# Altium project Atmega_328p_MCU_Circuit.PrjPcb
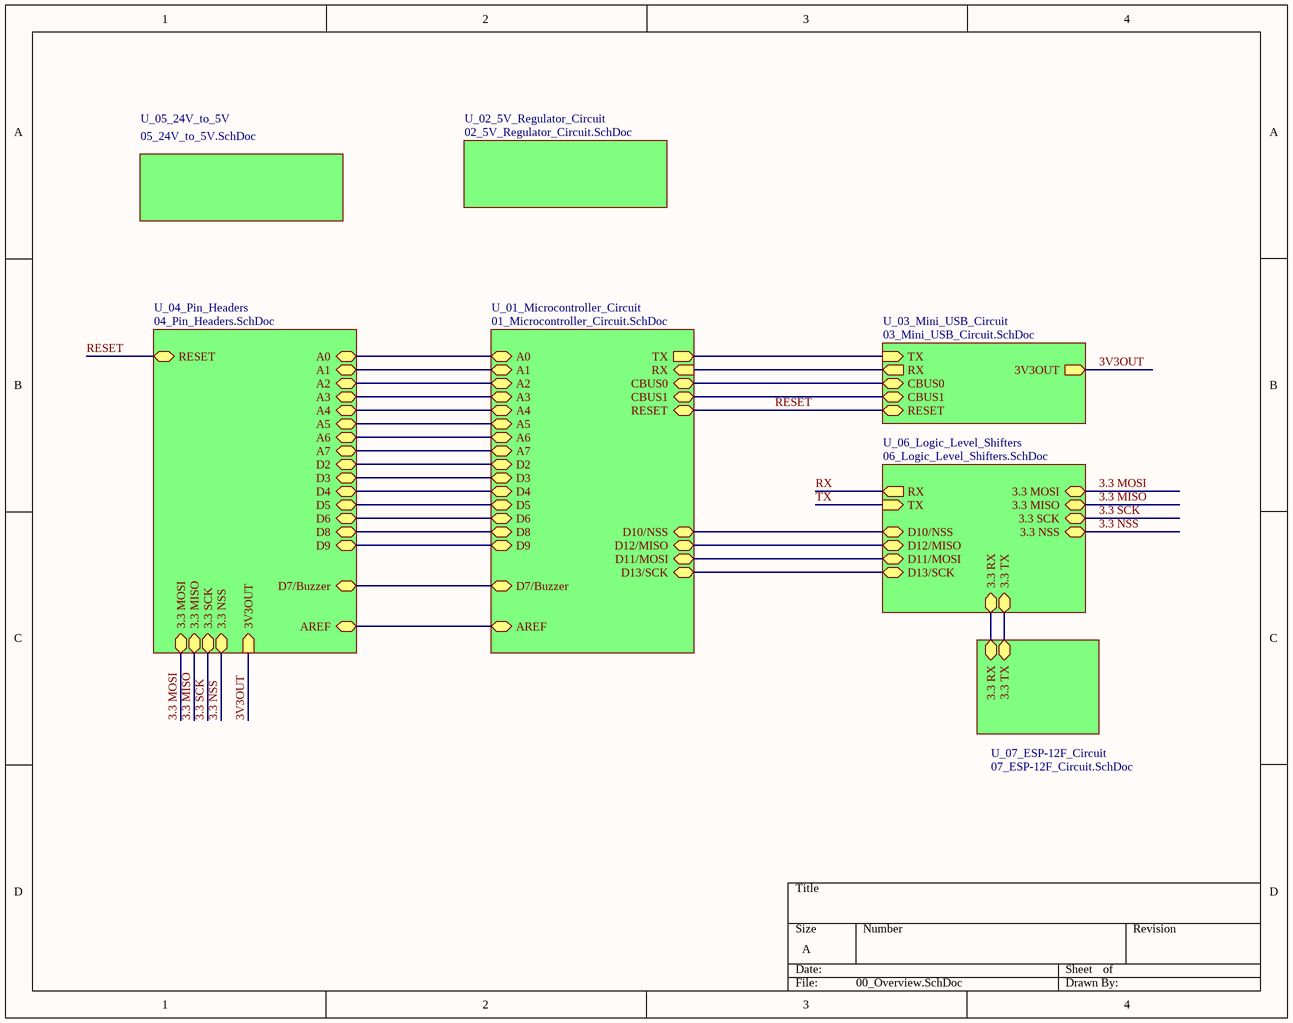
[diagram p0: 00_Overview.SchDoc]
7 sheets, 62 parts. Net scope: hierarchical (ports join the sheet entries above them; power ports are global).
Board file: PCB.PcbDoc
Sheets:
  00_Overview.SchDoc
    U_01_Microcontroller_Circuit = 01_Microcontroller_Circuit.SchDoc
    U_04_Pin_Headers = 04_Pin_Headers.SchDoc
    U_03_Mini_USB_Circuit = 03_Mini_USB_Circuit.SchDoc
    U_02_5V_Regulator_Circuit = 02_5V_Regulator_Circuit.SchDoc
    U_07_ESP-12F_Circuit = 07_ESP-12F_Circuit.SchDoc
    U_06_Logic_Level_Shifters = 06_Logic_Level_Shifters.SchDoc

## Sheet 00_Overview.SchDoc
size A; SheetNumber: 1; SheetTotal: 7

### Sub-sheets
U_01_Microcontroller_Circuit = 01_Microcontroller_Circuit.SchDoc: RX (in), TX (out), A0 (bidir), A1 (bidir), A2 (bidir), A3 (bidir), A4 (bidir), A5 (bidir), A6 (bidir), A7 (bidir), D2 (bidir), D3 (bidir), D4 (bidir), D5 (bidir), D6 (bidir), D8 (bidir), D9 (bidir), RESET (bidir), CBUS0 (bidir), CBUS1 (bidir), D11/MOSI (bidir), D12/MISO (bidir), AREF (bidir), D13/SCK (bidir), D10/NSS (bidir), D7/Buzzer (bidir)
U_02_5V_Regulator_Circuit = 02_5V_Regulator_Circuit.SchDoc: no entries
U_03_Mini_USB_Circuit = 03_Mini_USB_Circuit.SchDoc: TX (in), RX (out), RESET (bidir), CBUS0 (bidir), CBUS1 (bidir), 3V3OUT (out)
U_04_Pin_Headers = 04_Pin_Headers.SchDoc: RESET (bidir), D2 (bidir), D3 (bidir), D4 (bidir), D5 (bidir), D6 (bidir), D8 (bidir), D9 (bidir), A1 (bidir), A0 (bidir), AREF (bidir), A6 (bidir), A5 (bidir), A4 (bidir), A3 (bidir), A2 (bidir), A7 (bidir), D7/Buzzer (bidir), 3.3 MOSI (bidir), 3.3 NSS (bidir), 3.3 MISO (bidir), 3.3 SCK (bidir), 3V3OUT (in)
U_05_24V_to_5V = 05_24V_to_5V.SchDoc (file not in this document): no entries
U_06_Logic_Level_Shifters = 06_Logic_Level_Shifters.SchDoc: 3.3 NSS (bidir), 3.3 MISO (bidir), 3.3 MOSI (bidir), 3.3 SCK (bidir), D10/NSS (bidir), D12/MISO (bidir), D11/MOSI (bidir), D13/SCK (bidir), TX (in), RX (out), 3.3 RX (bidir), 3.3 TX (bidir)
U_07_ESP-12F_Circuit = 07_ESP-12F_Circuit.SchDoc: 3.3 TX (bidir), 3.3 RX (bidir)

### Nets
3.3 MISO: sheet U_04_Pin_Headers/3.3 MISO, sheet U_06_Logic_Level_Shifters/3.3 MISO
3.3 MOSI: sheet U_04_Pin_Headers/3.3 MOSI, sheet U_06_Logic_Level_Shifters/3.3 MOSI
3.3 NSS: sheet U_04_Pin_Headers/3.3 NSS, sheet U_06_Logic_Level_Shifters/3.3 NSS
3.3 RX: sheet U_07_ESP-12F_Circuit/3.3 RX, sheet U_06_Logic_Level_Shifters/3.3 RX
3.3 SCK: sheet U_04_Pin_Headers/3.3 SCK, sheet U_06_Logic_Level_Shifters/3.3 SCK
3.3 TX: sheet U_07_ESP-12F_Circuit/3.3 TX, sheet U_06_Logic_Level_Shifters/3.3 TX
3V3OUT: sheet U_04_Pin_Headers/3V3OUT, sheet U_03_Mini_USB_Circuit/3V3OUT
A0: sheet U_01_Microcontroller_Circuit/A0, sheet U_04_Pin_Headers/A0
A1: sheet U_01_Microcontroller_Circuit/A1, sheet U_04_Pin_Headers/A1
A2: sheet U_01_Microcontroller_Circuit/A2, sheet U_04_Pin_Headers/A2
A3: sheet U_01_Microcontroller_Circuit/A3, sheet U_04_Pin_Headers/A3
A4: sheet U_01_Microcontroller_Circuit/A4, sheet U_04_Pin_Headers/A4
A5: sheet U_01_Microcontroller_Circuit/A5, sheet U_04_Pin_Headers/A5
A6: sheet U_01_Microcontroller_Circuit/A6, sheet U_04_Pin_Headers/A6
A7: sheet U_01_Microcontroller_Circuit/A7, sheet U_04_Pin_Headers/A7
AREF: sheet U_01_Microcontroller_Circuit/AREF, sheet U_04_Pin_Headers/AREF
CBUS0: sheet U_01_Microcontroller_Circuit/CBUS0, sheet U_03_Mini_USB_Circuit/CBUS0
CBUS1: sheet U_01_Microcontroller_Circuit/CBUS1, sheet U_03_Mini_USB_Circuit/CBUS1
D2: sheet U_01_Microcontroller_Circuit/D2, sheet U_04_Pin_Headers/D2
D3: sheet U_01_Microcontroller_Circuit/D3, sheet U_04_Pin_Headers/D3
D4: sheet U_01_Microcontroller_Circuit/D4, sheet U_04_Pin_Headers/D4
D5: sheet U_01_Microcontroller_Circuit/D5, sheet U_04_Pin_Headers/D5
D6: sheet U_01_Microcontroller_Circuit/D6, sheet U_04_Pin_Headers/D6
D7/Buzzer: sheet U_01_Microcontroller_Circuit/D7/Buzzer, sheet U_04_Pin_Headers/D7/Buzzer
D8: sheet U_01_Microcontroller_Circuit/D8, sheet U_04_Pin_Headers/D8
D9: sheet U_01_Microcontroller_Circuit/D9, sheet U_04_Pin_Headers/D9
D10/NSS: sheet U_01_Microcontroller_Circuit/D10/NSS, sheet U_06_Logic_Level_Shifters/D10/NSS
D11/MOSI: sheet U_01_Microcontroller_Circuit/D11/MOSI, sheet U_06_Logic_Level_Shifters/D11/MOSI
D12/MISO: sheet U_01_Microcontroller_Circuit/D12/MISO, sheet U_06_Logic_Level_Shifters/D12/MISO
D13/SCK: sheet U_01_Microcontroller_Circuit/D13/SCK, sheet U_06_Logic_Level_Shifters/D13/SCK
RESET: sheet U_01_Microcontroller_Circuit/RESET, sheet U_04_Pin_Headers/RESET, sheet U_03_Mini_USB_Circuit/RESET
RXD: sheet U_01_Microcontroller_Circuit/TX, sheet U_03_Mini_USB_Circuit/TX
TXD: sheet U_01_Microcontroller_Circuit/RX, sheet U_03_Mini_USB_Circuit/RX

## Sheet 01_Microcontroller_Circuit.SchDoc
size A; SheetNumber: 2; SheetTotal: 8
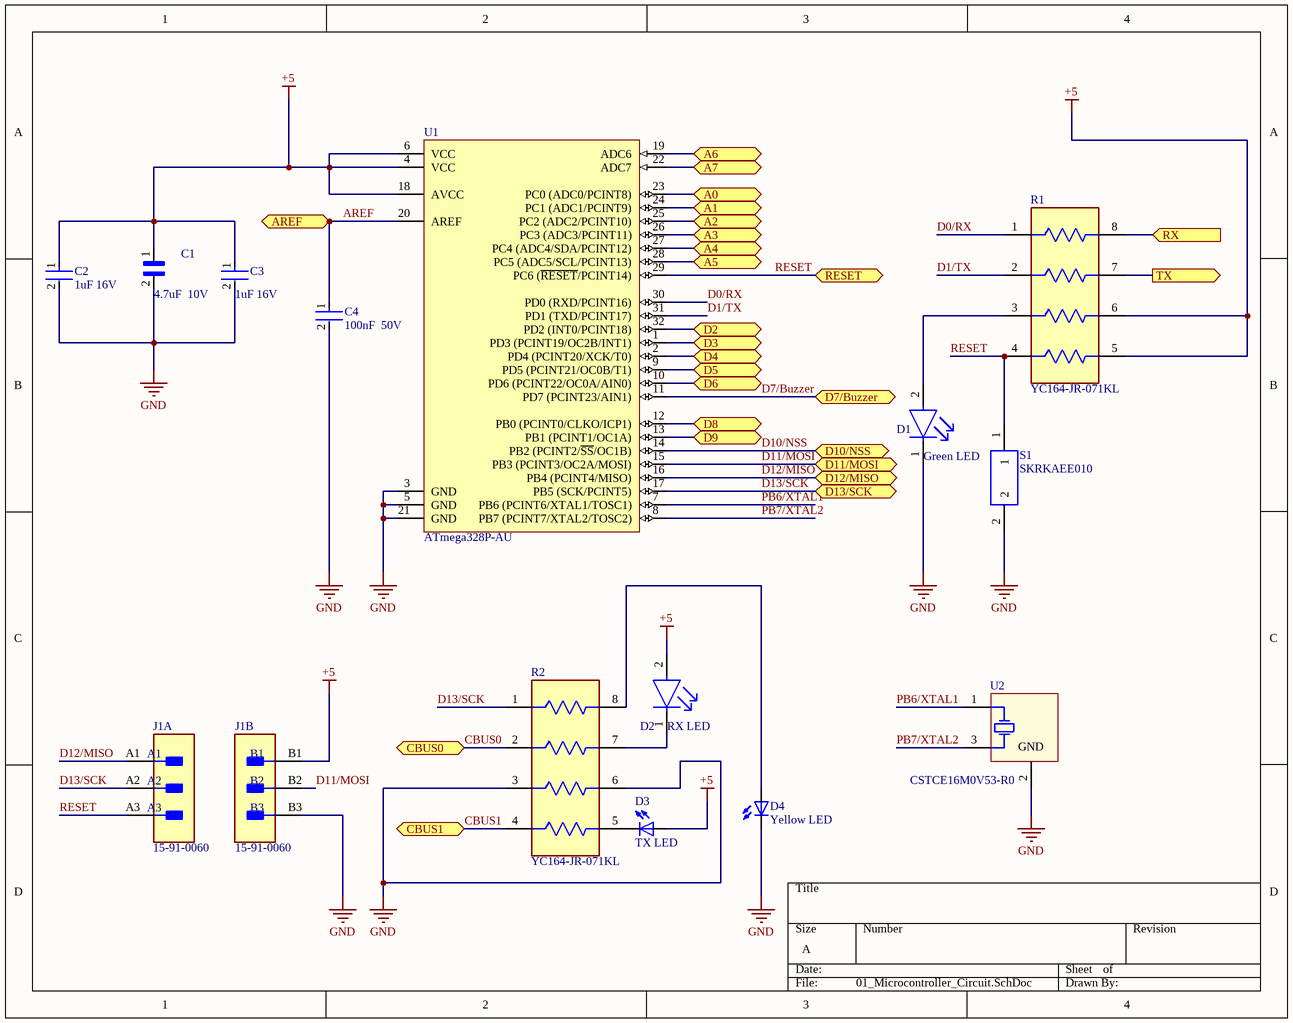
[diagram p1: 01_Microcontroller_Circuit.SchDoc]

### Parts
C1  4.7uF  10V  [CAPC1608X90]
C2  1uF 16V  [FP-CL10B105KO8NNNC-MFG]
C3  1uF 16V  [FP-CL10B105KO8NNNC-MFG]
C4  100nF  50V  [FP-0805-L_2_01_0_2-W_1_25-IPC_C]
D1  Green LED  [FP-LTST-C171KGKT-MFG]
D2  RX LED  [FP-LTST-C171KGKT-MFG]
D3  TX LED  [DIOC200X125X110]
D4  Yellow LED  [DIOC200X125X110]
J1  15-91-0060  [FP-15-91-0060-MFG]  (parts A,B of 2)
R1  YC164-JR-071KL  [FP-YC164-MFG]
R2  YC164-JR-071KL  [FP-YC164-MFG]
S1  SKRKAEE010  [SKRK]
U1  ATmega328P-AU  [32A_M]
U2  CSTCE16M0V53-R0  [MURA-CSTCE_V-3_V]

### Ports
A0 (bidir, see 00_Overview[2B], 04_Pin_Headers[3C]), A1 (bidir, see 00_Overview[2B], 04_Pin_Headers[3C]), A2 (bidir, see 00_Overview[2B], 04_Pin_Headers[3B]), A3 (bidir, see 00_Overview[2B], 04_Pin_Headers[3B]), A4 (bidir, see 00_Overview[2B], 04_Pin_Headers[3B]), A5 (bidir, see 00_Overview[2B], 04_Pin_Headers[3B]), A6 (bidir, see 00_Overview[2B], 04_Pin_Headers[3B]), A7 (bidir, see 00_Overview[2B], 04_Pin_Headers[3B]), AREF (bidir, see 00_Overview[2C], 04_Pin_Headers[3C]), CBUS0 (bidir, see 00_Overview[3B], 03_Mini_USB_Circuit[3B]), CBUS1 (bidir, see 00_Overview[3B], 03_Mini_USB_Circuit[3B]), D2 (bidir, see 00_Overview[2B], 04_Pin_Headers[1A]), D3 (bidir, see 00_Overview[2B], 04_Pin_Headers[1B]), D4 (bidir, see 00_Overview[2B], 04_Pin_Headers[1B]), D5 (bidir, see 00_Overview[2B], 04_Pin_Headers[1B]), D6 (bidir, see 00_Overview[2C], 04_Pin_Headers[1B]), D7/Buzzer (bidir, see 00_Overview[2C], 04_Pin_Headers[2D]), D8 (bidir, see 00_Overview[2C], 04_Pin_Headers[1B]), D9 (bidir, see 00_Overview[2C], 04_Pin_Headers[1B]), D10/NSS (bidir, see 00_Overview[3C], 06_Logic_Level_Shifters[2B]), D11/MOSI (bidir, see 00_Overview[3C], 06_Logic_Level_Shifters[4B]), D12/MISO (bidir, see 00_Overview[3C], 06_Logic_Level_Shifters[2C]), D13/SCK (bidir, see 00_Overview[3C], 06_Logic_Level_Shifters[4C]), RESET (bidir, see 00_Overview[3B], 03_Mini_USB_Circuit[4B], 04_Pin_Headers[1A]), RX (in, see 00_Overview[3B], 03_Mini_USB_Circuit[3A]), TX (out, see 00_Overview[3B], 03_Mini_USB_Circuit[3B])

### Nets
+5: C1.1 C2.1 C3.1 D2.2(A) D3.POS J1.B1 R1.5 R1.6 U1.4(VCC) U1.6(VCC) U1.18(AVCC)
GND: C1.2 C2.2 C3.2 C4.2 D1.1(C) D4.NEG J1.B3 R2.3 R2.6 S1.2 U1.3(GND) U1.5(GND) U1.21(GND) U2.2(GND)
A0: U1.23(PC0_(ADC0/PCINT8)) ; port A0
A1: U1.24(PC1_(ADC1/PCINT9)) ; port A1
A2: U1.25(PC2_(ADC2/PCINT10)) ; port A2
A3: U1.26(PC3_(ADC3/PCINT11)) ; port A3
A4: U1.27(PC4_(ADC4/SDA/PCINT12)) ; port A4
A5: U1.28(PC5_(ADC5/SCL/PCINT13)) ; port A5
A6: U1.19(ADC6) ; port A6
A7: U1.22(ADC7) ; port A7
AREF: C4.1 U1.20(AREF) ; port AREF
CBUS0: R2.2 ; port CBUS0
CBUS1: R2.4 ; port CBUS1
D0/RX: R1.1 U1.30(PD0_(RXD/PCINT16))
D1/TX: R1.2 U1.31(PD1_(TXD/PCINT17))
D2: U1.32(PD2_(INT0/PCINT18)) ; port D2
D3: U1.1(PD3_(PCINT19/OC2B/INT1)) ; port D3
D4: U1.2(PD4_(PCINT20/XCK/T0)) ; port D4
D5: U1.9(PD5_(PCINT21/OC0B/T1)) ; port D5
D6: U1.10(PD6_(PCINT22/OC0A/AIN0)) ; port D6
D7/Buzzer: U1.11(PD7_(PCINT23/AIN1)) ; port D7/Buzzer
D8: U1.12(PB0_(PCINT0/CLKO/ICP1)) ; port D8
D9: U1.13(PB1_(PCINT1/OC1A)) ; port D9
D10/NSS: U1.14(PB2_(PCINT2/~{SS}/OC1B)) ; port D10/NSS
D11/MOSI: J1.B2 U1.15(PB3_(PCINT3/OC2A/MOSI)) ; port D11/MOSI
D12/MISO: J1.A1 U1.16(PB4_(PCINT4/MISO)) ; port D12/MISO
D13/SCK: J1.A2 R2.1 U1.17(PB5_(SCK/PCINT5)) ; port D13/SCK
PB6/XTAL1: U1.7(PB6_(PCINT6/XTAL1/TOSC1)) U2.1(C1)
PB7/XTAL2: U1.8(PB7_(PCINT7/XTAL2/TOSC2)) U2.3(C2)
RESET: J1.A3 R1.4 S1.1 U1.29(PC6_(~{RESET}/PCINT14)) ; port RESET
RXD: R1.7 ; port TX
TXD: R1.8 ; port RX
NetD1_2: D1.2(A) R1.3
NetD2_1: D2.1(C) R2.7
NetD3_NEG: D3.NEG R2.5
NetD4_POS: D4.POS R2.8

### Library data of the parts
C1 = CC0603ZRY5V5BB475: SnapEDA_Link: https://www.snapeda.com/parts/CC0603ZRY5V5BB475/Yageo/view-part/?ref=snap; Check_prices: https://www.snapeda.com/parts/CC0603ZRY5V5BB475/Yageo/view-part/?ref=eda; Value: *
C2 C3 = CMP-2000-06093-2: CAP CER 1UF 16V X7R 0603; Manufacturer: Samsung Electro-Mechanics America, Inc; Manufacturer Part Number: CL10B105KO8NNNC; Temperature Coefficient: 15%; Material: Ceramic; Tolerance: 10%; Voltage Rating: 16V; Automotive: No; ComponentLink2Description: Datasheet; Device Class L3: Ceramic Capacitors; Capacitance: 1uF; Temperature Characteristic: X7R; Temperature Range High: +125°C; Digikey Description: CAP CER 1UF 16V X7R 0603; Device Class L2: Capacitors; Octopart: https://octopart.com/cl10b105ko8nnnc-samsung-19018973; ComponentLink2URL: http://www.samsungsem.com/global/front/downloadcms.do?path=%2F%2Fglobal%2F%2Fsupport%2F%2Fproduct-search%2F%2Fmlcc%2F%2F__icsFiles%2F%2Fafieldfile%2F%2F2019%2F%2F06%2F%2F18&fileName=CL10B105KO8NNNC-19.pdf; Lead Free: Yes; Height: 0.9mm; Package: CL10B105KO8NNNC; Temperature Range Low: -55°C; Value: 1uF; Device Class L1: Passive Components; RoHS: TRUE; Temperature: -55°C to +125°C; Category: Cap; Ipc Land Pattern Name: CAPC16080X80
C4 = CMP-2000-05016-2: General Purpose Ceramic Capacitor, 0805, 100nF, 10%, X7R, 0.15, 50V; Dissipation Factor: 2.5%; Insulation Resistance: 100GR; Voltage Rating (DC): 50V; Package Quantity: 4000; Tolerance: 10%; Voltage Rating: 50V; Dielectric: X7R; Case/Package: 0805; Lead Free: Lead Free; Dielectric Material: Ceramic; Thickness: 0.037inch; Weight: 0.001411oz; Max Operating Temperature: 125°C; REACH SVHC: No SVHC; Mount: Surface Mount; RoHS Compliant: Yes; Depth: 1.25mm; Height: 0.5mm; Case Code (Metric): 2012; Length: 2mm; Termination: Standard; Case Code (Imperial): 0805; Number of Pins: 2; Voltage: 50V; Radiation Hardening: No; Min Operating Temperature: -55°C; Capacitance: 100nF; Width: 1.2mm; Series: MLCC X7R; Packaging: Cut Tape
D1 D2 = CMP-22017-000037-1: LED GREEN CLEAR SMD; Number of LEDs: 1; Viewing Angle: 130°; Lens Style: Rectangular; Dominant Wavelength: 571nm; Test Current: 20mA; Luminous Intensity: 35mcd; Power Rating: 75mW; Forward Voltage: 2.4V; Forward Current: 30mA; Reverse Voltage: 5V; Lens Color: Colorless; Wavelength: 574nm; Height: 0.8mm; Illumination Color: Green; Length: 2mm; Case/Package: 0805; Number of Pins: 2; Number of Elements: 1; Package Quantity: 1; Depth: 1.25mm; Lens Transparency: Clear; Width: 1.25mm; Color: Green; Radiation Hardening: No; Mount: Surface Mount; Packaging: Tape and Reel; Case Code (Metric): 2012; Lead Free: Lead Free; Max Operating Temperature: 85°C; Min Operating Temperature: -55°C; Case Code (Imperial): 0805; Power Dissipation: 75mW
D3 D4 = LTST-C171KSKT: Yellow 587nm LED Indication - Discrete 2V 0805 (2012 Metric); MF: Lite-On Inc.; SnapEDA_Link: https://www.snapeda.com/parts/LTST-C171KSKT/Lite-On/view-part/?ref=snap; Package: 0805 Lite-On; Value: *; MP: LTST-C171KSKT; Check_prices: https://www.snapeda.com/parts/LTST-C171KSKT/Lite-On/view-part/?ref=eda
J1 = CMP-04776-000883-1: CONN HEADER SMD 6POS 2.54MM; Current Rating: 3A; Voltage Rating: 250V; Number of Positions: 6; Glow Wire Compliant: Non-compliant; Gender: Male; Max Voltage Rating (DC): 250.25kV; Package Quantity: 3000; Contact Plating: Gold; Halogen Free: Low Halogen; Mount: Surface Mount; Row Spacing: 2.54mm; Contact Material: Bronze; Number of Rows: 2; Min Operating Temperature: -40°C; Pitch: 2.54mm; Packaging: Bulk; Termination: SMD/SMT; Contact Gender: Male; Max Operating Temperature: 105°C; Voltage Rating (DC): 250V; Flammability Rating: UL94 V-0; Series: 71308; Number of Contacts: 6; Housing Material: Thermoplastic; Radiation Hardening: No; ELV: Compliant; Number of Circuits: 6; Housing Color: Black; Material: Bronze; Orientation: Straight; Lead Free: Lead Free
R1 R2 = CMP-03411-000004-1: RES ARRAY 4 RES 1K OHM 1206; Number of Terminals/Pins: 8; Resistance Tolerance: 5%; Temperature Coefficient: 200ppm/°C; Number of Circuits: 4; Resistance: 1kR; Power Per Element: 62.5mW; Voltage Rating: 50V; Circuit Type: Isolated; Case/Package: 0603; RoHS Compliant: Yes; Size Code: 0603; Tolerance: 5%; Min Operating Temperature: -55°C; Height: 0.028inch; Series: YC164; Number of Elements: 4; Length: 0.126inch; Number of Pins: 8; Number of Resistors: 4; Lead Free: Lead Free; Radiation Hardening: No; Max Operating Temperature: 155°C; Case Code (Metric): 3216; Working Voltage: 50V; Case Code (Imperial): 1206; Packaging: Cut Tape; Technology: THICK FILM; Number of Contacts: 8; Width: 0.063inch; Depth: 1.6mm; Terminal Pitch: 0.8mm; Power Dissipation: 62.5mW; Package Quantity: 1; Termination: Convex; Mount: Surface Mount; Military Standard: Not
S1 = SKRKAEE010: Switch Tactile N.O. SPST Round Button Gull Wing 0.05A 12VDC 1.57N SMD T/R; MF: ALPS; Availability: Unavailable; Price: None; Package: None; Value: *; SnapEDA_Link: https://www.snapeda.com/parts/SKRKAEE010/ALPS/view-part/380772/?ref=snap; MP: SKRKAEE010
U1 = CMP-0095-00269-2: 8-bit AVR Microcontroller, 32KB Flash, 1KB EEPROM, 2KB SRAM, 32-pin TQFP, Industrial Grade (-40°C to 85°C); PackageDescription: 32-Lead, 7x7x1.0 mm Body, 0.8mm Lead Pitch, Thin Profile Plastic Quad Flat Package (TQFP); DatasheetVersion: revD, May-2011; RevisionNote: DatasheetVersion & PackageVersion updated. URLs added.; ComponentLink1URL: http://www.atmel.com/; ComponentLink2Description: ATmega48A/48PA/88A/88PA/168A/168PA/328/328P Datasheet; Code_JEDEC: MS-026-ABA; ComponentLink1Description: Manufacturer URL; PackageReference: 32A; ComponentLink3Description: ATmega48A/48PA/88A/88PA/168A/168PA/328/328P Summary; ComponentLink2URL: http://www.atmel.com/dyn/resources/prod_documents/doc8271.pdf; PackageVersion: revC, Oct-2010; ComponentLink3URL: http://www.atmel.com/dyn/resources/prod_documents/8271S.pdf
U2 = CMP-0588-00001-2: Ceramic Resonator, 16 MHz with Built-in Capacitance, Thickness Expander Mode, Initial Frequency Tolerance +/- 0.5%, Load Capacity 15 pF, -20 to 80 degC, 3.2 x 1.3 x 1 mm SMD, RoHS, Reel; Manufacturer: Murata; Oscillating Frequency: 16 MHz; Load Capacity: 15 pF; PackageDescription: 3-Pin SMD, Body 3.2 x 1.3 mm, Pitch 0.95 mm; Mounting Technology: Surface Mount; ComponentLink1URL: http://www.murata.com/; RoHS: TRUE; Packing: Reel; Initial Frequency Tolerance: +/- 0.5%; PartNumber: CSTCE16M0V53-R0; ComponentLink2Description: Datasheet; DatasheetVersion: Rev. P16E-22; PackageReference: CSTCE_V-3; Operating Temperature Range: -20 to 80 degC; ComponentLink2URL: http://www.murata.com/products/catalog/pdf/p16e.pdf; ComponentLink1Description: Manufacturer URL; Initial Tolerance: +/- 0.5%

## Sheet 04_Pin_Headers.SchDoc
size A; SheetNumber: 5; SheetTotal: 8
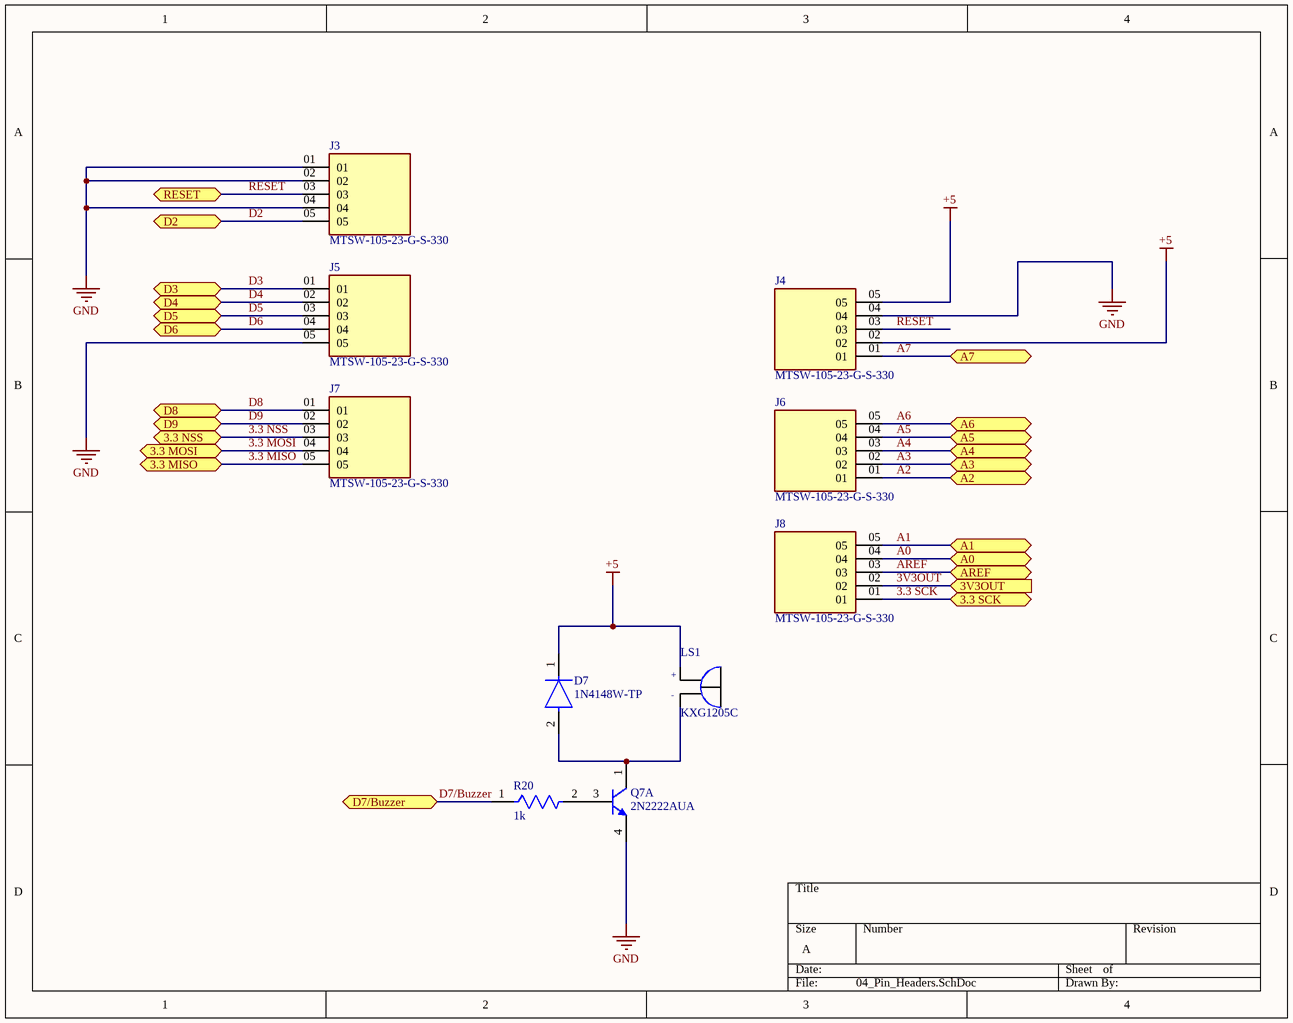
[diagram p2: 04_Pin_Headers.SchDoc]

### Parts
D7  1N4148W-TP  [FP-SOD-123-IPC_A]
J3  MTSW-105-23-G-S-330  [SAMTEC_MTSW-105-23-G-S-330]
J4  MTSW-105-23-G-S-330  [SAMTEC_MTSW-105-23-G-S-330]
J5  MTSW-105-23-G-S-330  [SAMTEC_MTSW-105-23-G-S-330]
J6  MTSW-105-23-G-S-330  [SAMTEC_MTSW-105-23-G-S-330]
J7  MTSW-105-23-G-S-330  [SAMTEC_MTSW-105-23-G-S-330]
J8  MTSW-105-23-G-S-330  [SAMTEC_MTSW-105-23-G-S-330]
LS1  KXG1205C  [*XDCR_KXG1205C_KXG1205C(Primary)]
Q7  2N2222AUA  [TT-MO-041BA-3_L]  (part A of 2)
R20  1k  [FP-TNPW1206-e3-MFG]

### Ports
3.3 MISO (bidir, see 00_Overview[1C], 06_Logic_Level_Shifters[1C]), 3.3 MOSI (bidir, see 00_Overview[1C], 06_Logic_Level_Shifters[3B]), 3.3 NSS (bidir, see 00_Overview[1C], 06_Logic_Level_Shifters[1B]), 3.3 SCK (bidir, see 00_Overview[1C], 06_Logic_Level_Shifters[3C]), 3V3OUT (in, see 00_Overview[1C], 03_Mini_USB_Circuit[1B]), A0 (bidir, see 00_Overview[2B], 01_Microcontroller_Circuit[3A]), A1 (bidir, see 00_Overview[2B], 01_Microcontroller_Circuit[3A]), A2 (bidir, see 00_Overview[2B], 01_Microcontroller_Circuit[3A]), A3 (bidir, see 00_Overview[2B], 01_Microcontroller_Circuit[3A]), A4 (bidir, see 00_Overview[2B], 01_Microcontroller_Circuit[3A]), A5 (bidir, see 00_Overview[2B], 01_Microcontroller_Circuit[3B]), A6 (bidir, see 00_Overview[2B], 01_Microcontroller_Circuit[3A]), A7 (bidir, see 00_Overview[2B], 01_Microcontroller_Circuit[3A]), AREF (bidir, see 00_Overview[2C], 01_Microcontroller_Circuit[1A]), D2 (bidir, see 00_Overview[2B], 01_Microcontroller_Circuit[3B]), D3 (bidir, see 00_Overview[2B], 01_Microcontroller_Circuit[3B]), D4 (bidir, see 00_Overview[2B], 01_Microcontroller_Circuit[3B]), D5 (bidir, see 00_Overview[2B], 01_Microcontroller_Circuit[3B]), D6 (bidir, see 00_Overview[2C], 01_Microcontroller_Circuit[3B]), D7/Buzzer (bidir, see 00_Overview[2C], 01_Microcontroller_Circuit[3B]), D8 (bidir, see 00_Overview[2C], 01_Microcontroller_Circuit[3B]), D9 (bidir, see 00_Overview[2C], 01_Microcontroller_Circuit[3B]), RESET (bidir, see 00_Overview[1B], 01_Microcontroller_Circuit[3B], 03_Mini_USB_Circuit[4B])

### Nets
+5: D7.1(C) J4.02 J4.05 LS1.P(POS)
GND: J3.01 J3.02 J3.04 J4.04 J5.05 Q7.4(E)
3.3 MISO: J7.05 ; port 3.3 MISO
3.3 MOSI: J7.04 ; port 3.3 MOSI
3.3 NSS: J7.03 ; port 3.3 NSS
3.3 SCK: J8.01 ; port 3.3 SCK
3V3OUT: J8.02 ; port 3V3OUT
A0: J8.04 ; port A0
A1: J8.05 ; port A1
A2: J6.01 ; port A2
A3: J6.02 ; port A3
A4: J6.03 ; port A4
A5: J6.04 ; port A5
A6: J6.05 ; port A6
A7: J4.01 ; port A7
AREF: J8.03 ; port AREF
D2: J3.05 ; port D2
D3: J5.01 ; port D3
D4: J5.02 ; port D4
D5: J5.03 ; port D5
D6: J5.04 ; port D6
D7/Buzzer: R20.1 ; port D7/Buzzer
D8: J7.01 ; port D8
D9: J7.02 ; port D9
RESET: J3.03 J4.03 ; port RESET
NetD7_2: D7.2(A) LS1.N(NEG) Q7.1(C)
NetQ7_3: Q7.3(B) R20.2

### Notes on the sheet
- (in symbol KXG1205C) +; -

### Library data of the parts
D7 = CMP-2000-04993-2: DIODE GEN PURP 100V 150MA SOD123; Max Reverse Leakage Current: 5uA; Max Surge Current: 2A; Reverse Recovery Time: 4ns; Polarity: Standard; Capacitance: 4pF; Max Forward Surge Current (Ifsm): 1A; Element Configuration: Single; Power Dissipation: 400mW; Forward Voltage: 1V; Radiation Hardening: No; Lead Free: Lead Free; Max Reverse Voltage (DC): 100V; Current Rating: 150mA; Forward Current: 150mA; Packaging: Tape and Reel; Number of Pins: 2; Package Quantity: 3000; Max Operating Temperature: 150°C; Min Operating Temperature: -65°C; Average Rectified Current: 150mA; Recovery Time: 4ns; Output Current: 150mA; Peak Non-Repetitive Surge Current: 2A; Width: 1.8mm; Voltage Rating (DC): 100V; Height: 1.2mm; Max Repetitive Reverse Voltage (Vrrm): 100V; Mount: Surface Mount; Length: 2.85mm
Q7 = CMP-2000-05559-1: Silicon Switching NPN Transistor, 800 mA, 50 V, -65 to 200 degC, 4-Pin LCC (MO-041BA), RoHS; Manufacturer: TT Electronics; DC Current Gain (hFE) (Min) @ Ic, Vce: 75@1mA,10V; Vce Saturation (Max) @ Ib, Ic: 1V@50mA,500mA; Current - Collector Cutoff (Max): 50nA; Current - Collector (Ic) (Max): 800mA; PCN Design/Specification: TransistorDieChange20/Jun/2014; Voltage - Collector Emitter Breakdown (Max): 50V; Power - Max: 500mW; Online Catalog: NPNTransistors; Other Names: 2N2222AUA-ND365-1563; Mounting Type: SurfaceMount; Package Description: 4-Pin Leadless Chip Carrier, Body 5.59 x 3.81 mm, Pitch 1.27 mm; Manufacturer URL: http://www.ttelectronics.com/; Datasheet Version: 08/2012; Package / Case: 4-CLCC; Package Reference: MO-041BA; Series: -; Category: DiscreteSemiconductorProducts; Transistor Type: NPN; Supplier Device Package: CeramicSMD; Packaging: Bulk; Mounting Technology: SurfaceMount; Family: Transistors(BJT)-Single; Datasheet URL: http://www.ttelectronics.com/themes/ttelectronics/datasheets/semiconductors/transistors/2N2222AUA.pdf; Frequency - Transition: -; Standard Package: 1
R20 = CMP-2003-04601-2: TNPW12061K00BEEA; NexarPartId: 42338284; Voltage Rating: 200V; Max Power Dissipation: 250mW; Tolerance: 0.1%; Resistance: 1kΩ; Temperature Coefficient: 25ppm/°C; Lead Free: Lead Free; Packaging: Cut Tape; Termination: SMD/SMT; Case Code (Imperial): 1206; Schedule B: 8533210045, 8533210045; Power Rating: 250mW; Military Standard: Not; Min Operating Temperature: -55°C; Radiation Hardening: No; Contact Plating: Tin; Composition: Thin Film; Case Code (Metric): 3216; Max Operating Temperature: 125°C; Width: 1.6002mm; Weight: 16.187578mg; Length: 3.2mm; Features: Anti-Sulfur, Automotive AEC-Q200, Moisture Resistant; REACH SVHC: Unknown; Height: 550µm; Depth: 1.6mm; RoHS: Compliant; Number of Terminations: 2; Voltage Rating (DC): 200V; Case/Package: 1206; Number of Pins: 2
J3-J8 = MTSW-105-23-G-S-330: Availability: Unavailable; Price: None; MP: MTSW-105-23-G-S-330; Package: None; Value: *
LS1 = KXG1205C: SnapEDA_Link: https://www.snapeda.com/parts/KXG1205C/Kingstate/view-part/?ref=snap; Check_prices: https://www.snapeda.com/parts/KXG1205C/Kingstate/view-part/?ref=eda; Value: *

## Sheet 03_Mini_USB_Circuit.SchDoc
size A; SheetNumber: 4; SheetTotal: 8
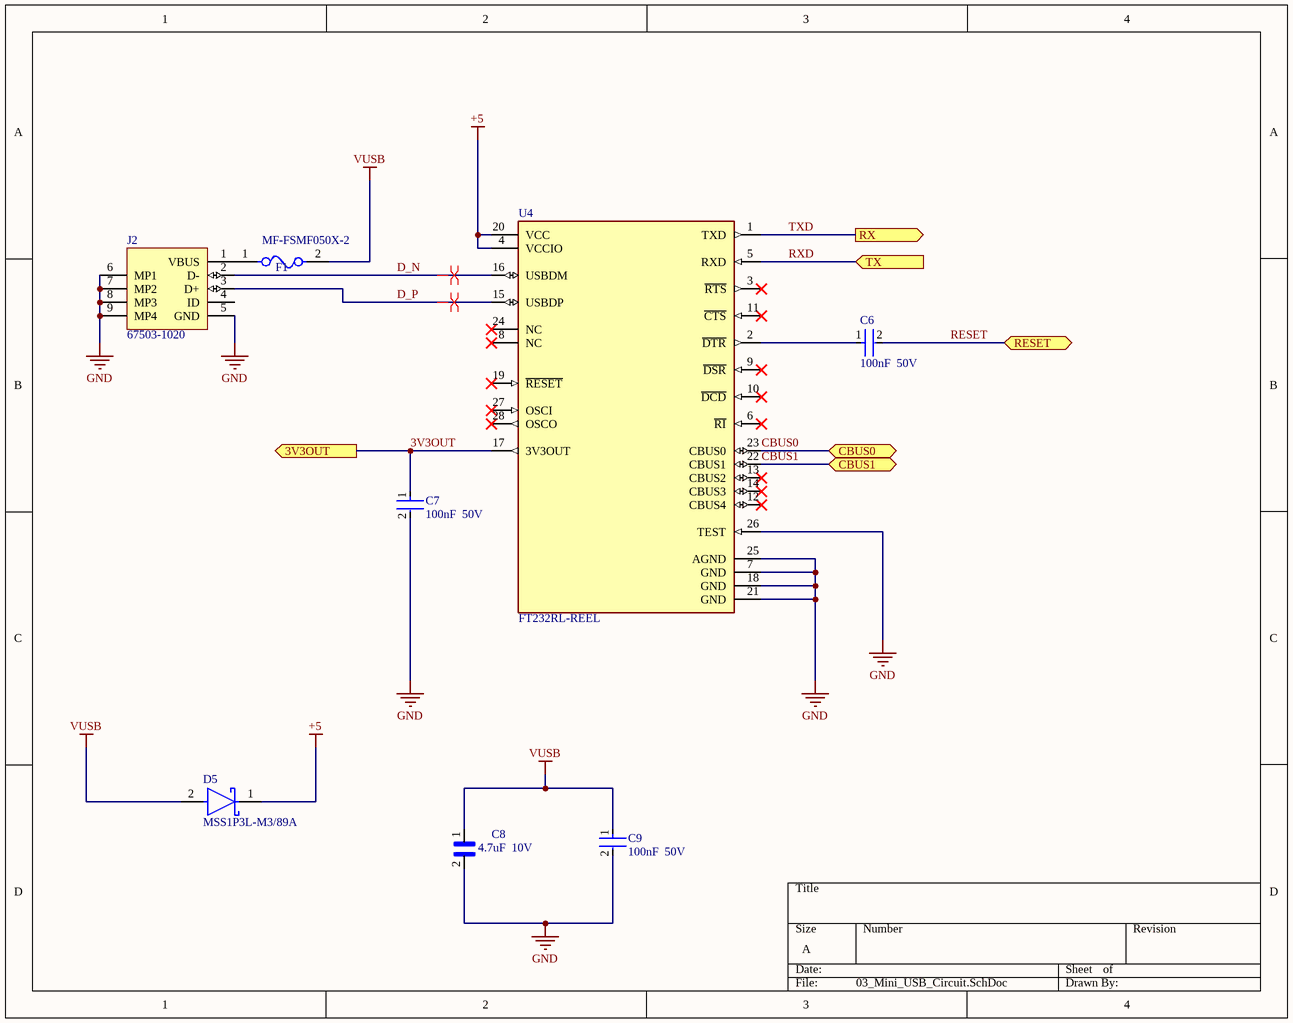
[diagram p3: 03_Mini_USB_Circuit.SchDoc]

### Parts
C6  100nF  50V  [FP-0805-L_2_01_0_2-W_1_25-IPC_C]
C7  100nF  50V  [FP-0805-L_2_01_0_2-W_1_25-IPC_C]
C8  4.7uF  10V  [CAPC1608X90]
C9  100nF  50V  [FP-0805-L_2_01_0_2-W_1_25-IPC_C]
D5  MSS1P3L-M3/89A  [FP-96591-MFG]
F1  MF-FSMF050X-2  [FP-MF-FSMF-MFG]
J2  67503-1020  [MOLX-67503-1020_V]
U4  FT232RL-REEL  [FP-SSOP-28-MFG]

### Ports
3V3OUT (out, see 00_Overview[4B], 04_Pin_Headers[3C]), CBUS0 (bidir, see 00_Overview[3B], 01_Microcontroller_Circuit[2C]), CBUS1 (bidir, see 00_Overview[3B], 01_Microcontroller_Circuit[2D]), RESET (bidir, see 00_Overview[3B], 01_Microcontroller_Circuit[3B], 04_Pin_Headers[1A]), RX (out, see 00_Overview[3B], 01_Microcontroller_Circuit[4A]), TX (in, see 00_Overview[3B], 01_Microcontroller_Circuit[4B])

### Nets
+5: D5.1(C) U4.4(VCCIO) U4.20(VCC)
GND: C7.2 C8.2 C9.2 J2.5(GND) J2.6(MP1) J2.7(MP2) J2.8(MP3) J2.9(MP4) U4.7(GND) U4.18(GND) U4.21(GND) U4.25(AGND) U4.26(TEST)
VUSB: C8.1 C9.1 D5.2(A) F1.2
3V3OUT: C7.1 U4.17(3V3OUT) ; port 3V3OUT
CBUS0: U4.23(CBUS0) ; port CBUS0
CBUS1: U4.22(CBUS1) ; port CBUS1
D_N: J2.2(D-) U4.16(USBDM)
D_P: J2.3(D+) U4.15(USBDP)
RESET: C6.2 ; port RESET
RXD: U4.5(RXD) ; port TX
TXD: U4.1(TXD) ; port RX
NetC6_1: C6.1 U4.2(~{DTR})
NetF1_1: F1.1 J2.1(VBUS)

Not connected (* = marked no-connect by the designer): J2 4(ID); U4 3(~{RTS})* 6(~{RI})* 8(NC)* 9(~{DSR})* 10(~{DCD})* 11(~{CTS})* 12(CBUS4)* 13(CBUS2)* 14(CBUS3)* 19(~{RESET})* 24(NC)* 27(OSCI)* 28(OSCO)*

### Layout directives
differential pair: D_N, D_P

### Library data of the parts
C6 C7 C9 = CMP-2000-05016-2: as C4 on sheet 01_Microcontroller_Circuit; Voltage Rating (DC): 50V; Package Quantity: 4000; Tolerance: 10%; Voltage Rating: 50V; Dielectric: X7R; Case/Package: 0805; Lead Free: Lead Free; Dielectric Material: Ceramic; Thickness: 0.037inch; Weight: 0.001411oz; Max Operating Temperature: 125°C; REACH SVHC: No SVHC; Mount: Surface Mount; RoHS Compliant: Yes; Depth: 1.25mm; Height: 0.5mm; Case Code (Metric): 2012; Length: 2mm; Termination: Standard; Case Code (Imperial): 0805; Number of Pins: 2; Voltage: 50V; Radiation Hardening: No; Min Operating Temperature: -55°C; Capacitance: 100nF; Width: 1.2mm; Series: MLCC X7R; Packaging: Cut Tape
C8 = CC0603ZRY5V5BB475: SnapEDA_Link: https://www.snapeda.com/parts/CC0603ZRY5V5BB475/Yageo/view-part/?ref=snap; Check_prices: https://www.snapeda.com/parts/CC0603ZRY5V5BB475/Yageo/view-part/?ref=eda; Value: *
D5 = CMP-02539-000006-1: DIODE SCHOTTKY 30V 1A MICROSMP; Manufacturer: Vishay; Max Junction Temp: +150°C; Max Surge Forward Current: 25A; Value: 65pF; Peak Reverse Current: 15uA; Max Repetitive Reverse Voltage: 30V; Mouser Description: Schottky Diodes & Rectifiers 1.0 Amp 30 Volt; Device Class L2: Diodes; RoHS: TRUE; Temperature Range Low: -55°C; ComponentLink2URL: http://www.vishay.com/docs/89020/mss1p3l.pdf; Octopart: https://octopart.com/mss1p3l-m3%2F89a-vishay-42670898; Automotive: No; Height: 0.73mm; Temperature: -55°C to +150°C; Temperature Range High: +150°C; ComponentLink2Description: Datasheet; Lead Free: Yes; Digikey Description: DIODE SCHOTTKY 30V 1A MICROSMP; Forward Current: 1A; Manufacturer Part Number: MSS1P3L-M3/89A; Footprint Url: http://www.vishay.com/docs/96591/microsmp_do-219ad_fredpt.pdf; Device Class L1: Discrete Semiconductors; Capacitance: 65pF; Device Class L3: Schottky Diodes; Package: 96591; Category: Diode
F1 = CMP-07400-000010-1: PTC RESET FUSE 6V 500MA 0603; Manufacturer: Bourns Inc.; Trip Current: 1A; Current Rating: 40A; Hold Current: 0.5A; Resistance: 0.1-0.8Ω; Value: 0.1-0.8Ω; Trip Time: 0.1s; Mouser Description: Resettable Fuses - PPTC 6volts 40amps; Category: Fuse; Digikey Description: PTC RESET FUSE 6V 500MA 0603; Temperature: -40°C to +85°C; Device Class L3: unset; Automotive: No; RoHS: TRUE; Ambient Temperature Range High: +85°C; Device Class L2: PTC Resettable Fuses; Temperature Range High: +85°C; Voltage Rating: 6V; Package: MF-FSMF; Manufacturer Part Number: MF-FSMF050X-2; Ambient Temperature Range Low: -40°C; Lead Free: Yes; ComponentLink2Description: Datasheet; Octopart: https://octopart.com/mf-fsmf050x-2-bourns-10470804; ComponentLink2URL: https://www.bourns.com/docs/Product-Datasheets/mffsmf.pdf; Temperature Range Low: -40°C; Height: 1mm; Device Class L1: Circuit Protection
J2 = CMP-0411-00002-1: USB, MINI, SMD, RA KME04-USBMU03A01; Manufacturer: Molex; ComponentLink1URL: http://www.molex.com/; PartNumber: 67503-1020; Mounting Technology: Surface Mount; ComponentLink1Description: Manufacturer URL; Terminal Pitch: 0.8 mm; DatasheetVersion: Rev F, 06/2009; ComponentLink2Description: Datasheet; PackageDescription: Mini USB Connector, SMT, Righer Angle; ComponentLink2URL: http://www.molex.com/pdm_docs/sd/675031020_sd.pdf; PackageReference: 67503-1020
U4 = CMP-0078-00029-4: IC USB FS SERIAL UART 28-SSOP; Data Rate: 12Mbps; Max Supply Voltage: 5.25V; Operating Supply Current: 15mA; Number of Channels: 1; Voltage: 5V; Min Supply Voltage: 3.3V; Radiation Hardening: No; Mount: Surface Mount; Min Operating Temperature: -40°C; Package Quantity: 2000; Number of Transceivers: 1; Width: 5.3mm; Number of Pins: 28; Height: 1.75mm; Weight: 0.080001oz; Lead Free: Lead Free; Length: 10.2mm; REACH SVHC: No SVHC; Max Operating Temperature: 85°C; Packaging: Tape and Reel; Interface: UART; Case/Package: SSOP

## Sheet 02_5V_Regulator_Circuit.SchDoc
size A; SheetNumber: 3; SheetTotal: 8
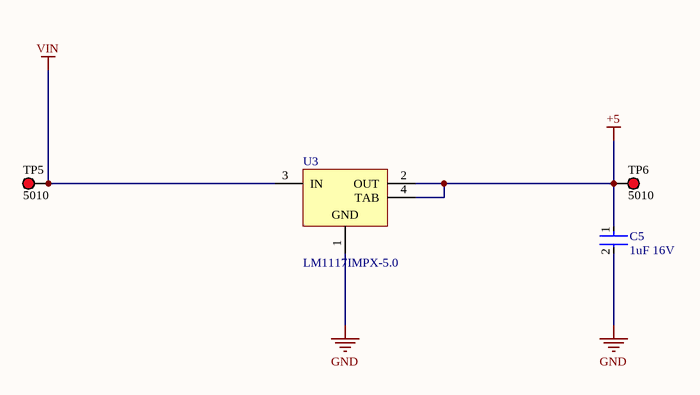
[diagram p4: 02_5V_Regulator_Circuit.SchDoc]

### Parts
C5  1uF 16V  [FP-CL10B105KO8NNNC-MFG]
TP5  5010  [KSTN-5010_V]
TP6  5010  [KSTN-5010_V]
U3  LM1117IMPX-5.0  [DCY0004A_M]

### Nets
+5: C5.1 TP6.1 U3.2(OUT) U3.4(TAB)
GND: C5.2 U3.1(GND)
VIN: TP5.1 U3.3(IN)

### Library data of the parts
C5 = CMP-2000-06093-2: as C2 on sheet 01_Microcontroller_Circuit; Voltage Rating: 16V; Automotive: No; ComponentLink2Description: Datasheet; Device Class L3: Ceramic Capacitors; Capacitance: 1uF; Temperature Characteristic: X7R; Temperature Range High: +125°C; Digikey Description: CAP CER 1UF 16V X7R 0603; Device Class L2: Capacitors; Octopart: https://octopart.com/cl10b105ko8nnnc-samsung-19018973; ComponentLink2URL: http://www.samsungsem.com/global/front/downloadcms.do?path=%2F%2Fglobal%2F%2Fsupport%2F%2Fproduct-search%2F%2Fmlcc%2F%2F__icsFiles%2F%2Fafieldfile%2F%2F2019%2F%2F06%2F%2F18&fileName=CL10B105KO8NNNC-19.pdf; Lead Free: Yes; Height: 0.9mm; Package: CL10B105KO8NNNC; Temperature Range Low: -55°C; Value: 1uF; Device Class L1: Passive Components; RoHS: TRUE; Temperature: -55°C to +125°C; Category: Cap; Ipc Land Pattern Name: CAPC16080X80
TP5 TP6 = CMP-1672-00002-4: Test Point, Red, Through Hole, RoHS, Bulk; Manufacturer: Keystone; Contact Material: Bronze; Mounting Technology: Through Hole; RoHSCompliant: true; Pins: 1; Package Quantity: 100; ComponentLink2Description: Datasheet; Height: 8.12 mm; ComponentLink1URL: http://www.keyelco.com/; DatasheetVersion: Rev. F, 12/2013; Mount: Through Hole; PackageReference: 5010; Contact Plating: Silver; Packaging: Bulk; Colour: Red; REACH SVHC: No SVHC; PackageDescription: 1-Pin Through Hole Device, Dia 3.17 mm; ComponentLink2URL: http://www.keyelco.com/product-pdf.cfm?p=1319; ComponentLink1Description: Manufacturer URL
U3 = CMP-0062-01626-4: 800mA Low-Dropout Linear Regulator, 4-pin SOT-223; Manufacturer: Texas Instruments; PowerWise: N; CompType: LDO IC; High-Reliability: Y; PackageTopMarking: XYTT*N06B; ComponentLink1URL: http://www.ti.com/general/docs/lit/getliterature.tsp?genericPartNumber=LM1117-N&fileType=pdf; RoHS: N; PackageDescription: Molded SOT-223, 6.50 x 3.56 x 1.6mm Body, 4 Lead, 2.3mm Pitch; Code_JEDEC: TO-261-AA; ComponentLink1Description: Datasheet URL; PinCount: 4; PackageReference: DCY0004A; Code_IPC: SOT223-4; PartNumber: LM1117IMPX-5.0

## Sheet 07_ESP-12F_Circuit.SchDoc
size A; SheetNumber: 8; SheetTotal: 8
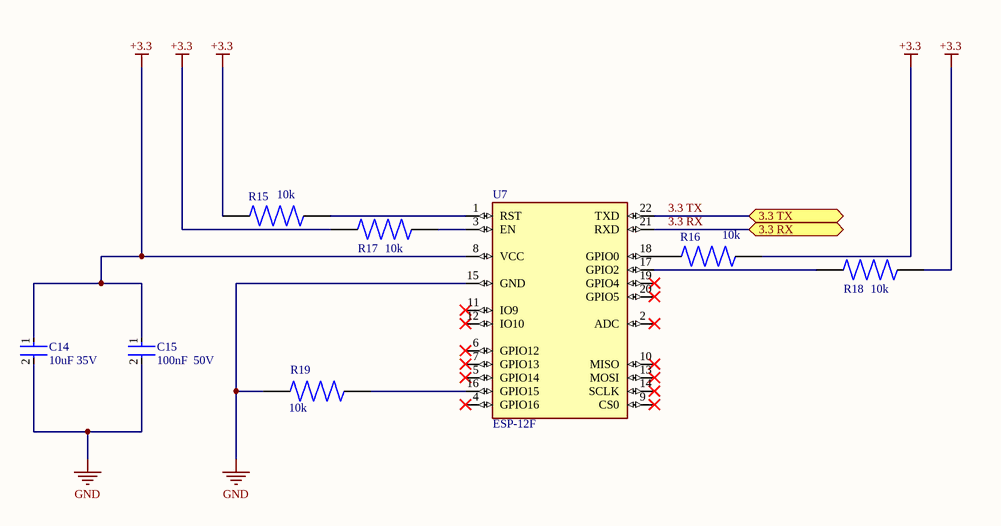
[diagram p5: 07_ESP-12F_Circuit.SchDoc]

### Parts
C14  10uF 35V  [FP-GRM21B-0_2-e0_2_0_7-IPC_B]
C15  100nF  50V  [FP-0805-L_2_01_0_2-W_1_25-IPC_C]
R15  10k  [RESC3115X65N]
R16  10k  [RESC3115X65N]
R17  10k  [RESC3115X65N]
R18  10k  [RESC3115X65N]
R19  10k  [RESC3115X65N]
U7  ESP-12F  [ESP-12F]

### Ports
3.3 RX (bidir, see 00_Overview[4C], 06_Logic_Level_Shifters[3D]), 3.3 TX (bidir, see 00_Overview[4C], 06_Logic_Level_Shifters[1D])

### Nets
+3.3: C14.1 C15.1 R15.1 R16.2 R17.1 R18.2 U7.8(VCC)
GND: C14.2 C15.2 R19.1 U7.15(GND)
3.3 RX: U7.21(RXD) ; port 3.3 RX
3.3 TX: U7.22(TXD) ; port 3.3 TX
NetR15_2: R15.2 U7.1(RST)
NetR16_1: R16.1 U7.18(GPIO0)
NetR17_2: R17.2 U7.3(EN)
NetR18_1: R18.1 U7.17(GPIO2)
NetR19_2: R19.2 U7.16(GPIO15)

Not connected (* = marked no-connect by the designer): U7 2(ADC)* 4(GPIO16)* 5(GPIO14)* 6(GPIO12)* 7(GPIO13)* 9(CS0)* 10(MISO)* 11(IO9)* 12(IO10)* 13(MOSI)* 14(SCLK)* 19(GPIO4)* 20(GPIO5)*

### Library data of the parts
C14 = CMP-06035-010759-1: Chip Multilayer Ceramic Capacitors for General Purpose, 0805, 10uF, X5R, 15%, 20%, 35V; Length: 0.079inch; Packaging: Tape and Reel; Weight: 0.000335oz; Height: 1.25mm; Max Operating Temperature: 85°C; Thickness: 0.057inch; Case Code (Metric): 2012; Voltage Rating: 35V; Voltage Rating (DC): 35V; Mount: Surface Mount; Case Code (Imperial): 0805; Width: 0.049inch; Package Quantity: 3000; Tolerance: 20%; Capacitance: 10uF; Min Operating Temperature: -55°C; Case/Package: 0805; Termination: SMD/SMT; Dielectric: X5R
C15 = CMP-2000-05016-2: as C4 on sheet 01_Microcontroller_Circuit; Voltage Rating (DC): 50V; Package Quantity: 4000; Tolerance: 10%; Voltage Rating: 50V; Dielectric: X7R; Case/Package: 0805; Lead Free: Lead Free; Dielectric Material: Ceramic; Thickness: 0.037inch; Weight: 0.001411oz; Max Operating Temperature: 125°C; REACH SVHC: No SVHC; Mount: Surface Mount; RoHS Compliant: Yes; Depth: 1.25mm; Height: 0.5mm; Case Code (Metric): 2012; Length: 2mm; Termination: Standard; Case Code (Imperial): 0805; Number of Pins: 2; Voltage: 50V; Radiation Hardening: No; Min Operating Temperature: -55°C; Capacitance: 100nF; Width: 1.2mm; Series: MLCC X7R; Packaging: Cut Tape
R15-R19 = 1206W4F1002T5E: 10K Ohm 1/4W Thick Film Resistor 1206 Chip - Surface Mount; MF: Uni-Royal; SnapEDA_Link: https://www.snapeda.com/parts/1206W4F1002T5E/Uni-Royal/view-part/?ref=snap; Package: 1206-2 ROYAL; Value: *; MP: 1206W4F1002T5E; Check_prices: https://www.snapeda.com/parts/1206W4F1002T5E/Uni-Royal/view-part/?ref=eda
U7 = ESP-12F: WiFi Module; MF: AI-Thinker; SnapEDA_Link: https://www.snapeda.com/parts/ESP-12F/AI-Thinker/view-part/?ref=snap; Package: Package; Value: *; MP: ESP-12F; Check_prices: https://www.snapeda.com/parts/ESP-12F/AI-Thinker/view-part/?ref=eda

## Sheet 06_Logic_Level_Shifters.SchDoc
size A; SheetNumber: 7; SheetTotal: 8
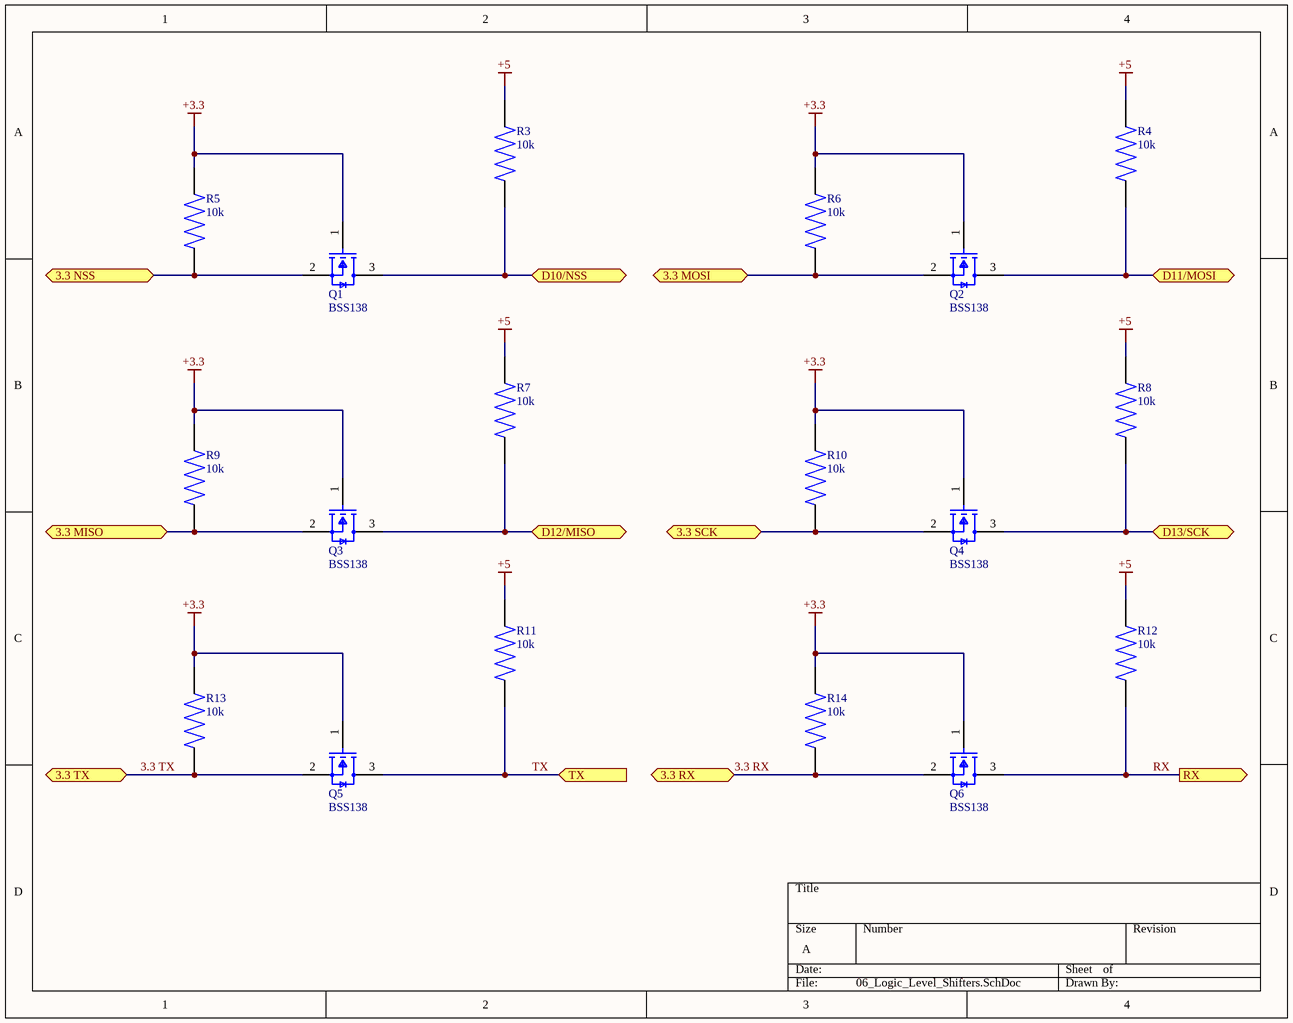
[diagram p6: 06_Logic_Level_Shifters.SchDoc]

### Parts
Q1  BSS138  [FP-318-08-IPC_B]
Q2  BSS138  [FP-318-08-IPC_B]
Q3  BSS138  [FP-318-08-IPC_B]
Q4  BSS138  [FP-318-08-IPC_B]
Q5  BSS138  [FP-318-08-IPC_B]
Q6  BSS138  [FP-318-08-IPC_B]
R3  10k  [RESC3115X65N]
R4  10k  [RESC3115X65N]
R5  10k  [RESC3115X65N]
R6  10k  [RESC3115X65N]
R7  10k  [RESC3115X65N]
R8  10k  [RESC3115X65N]
R9  10k  [RESC3115X65N]
R10  10k  [RESC3115X65N]
R11  10k  [RESC3115X65N]
R12  10k  [RESC3115X65N]
R13  10k  [RESC3115X65N]
R14  10k  [RESC3115X65N]

### Ports
3.3 MISO (bidir, see 00_Overview[4B], 04_Pin_Headers[1B]), 3.3 MOSI (bidir, see 00_Overview[4B], 04_Pin_Headers[1B]), 3.3 NSS (bidir, see 00_Overview[4C], 04_Pin_Headers[1B]), 3.3 RX (bidir, see 00_Overview[4C], 07_ESP-12F_Circuit[3B]), 3.3 SCK (bidir, see 00_Overview[4C], 04_Pin_Headers[3C]), 3.3 TX (bidir, see 00_Overview[4C], 07_ESP-12F_Circuit[3B]), D10/NSS (bidir, see 00_Overview[3C], 01_Microcontroller_Circuit[3B]), D11/MOSI (bidir, see 00_Overview[3C], 01_Microcontroller_Circuit[3B]), D12/MISO (bidir, see 00_Overview[3C], 01_Microcontroller_Circuit[3B]), D13/SCK (bidir, see 00_Overview[3C], 01_Microcontroller_Circuit[3B]), RX (out, see 00_Overview[3B]), TX (in, see 00_Overview[3B])

### Nets
+3.3: Q1.1(G) Q2.1(G) Q3.1(G) Q4.1(G) Q5.1(G) Q6.1(G) R5.2 R6.2 R9.2 R10.2 R13.2 R14.2
+5: R3.2 R4.2 R7.2 R8.2 R11.2 R12.2
3.3 MISO: Q3.2(S) R9.1 ; port 3.3 MISO
3.3 MOSI: Q2.2(S) R6.1 ; port 3.3 MOSI
3.3 NSS: Q1.2(S) R5.1 ; port 3.3 NSS
3.3 RX: Q6.2(S) R14.1 ; port 3.3 RX
3.3 SCK: Q4.2(S) R10.1 ; port 3.3 SCK
3.3 TX: Q5.2(S) R13.1 ; port 3.3 TX
D10/NSS: Q1.3(D) R3.1 ; port D10/NSS
D11/MOSI: Q2.3(D) R4.1 ; port D11/MOSI
D12/MISO: Q3.3(D) R7.1 ; port D12/MISO
D13/SCK: Q4.3(D) R8.1 ; port D13/SCK
RX: Q6.3(D) R12.1 ; port RX
TX: Q5.3(D) R11.1 ; port TX

### Library data of the parts
Q1-Q6 = CMP-07173-000101-1: MOSFET N-CH 50V 220MA SOT-23; Turn-Off Delay Time: 20ns; Element Configuration: Single; Rds On Max: 3.5R; Gate to Source Voltage (Vgs): 20V; Threshold Voltage: 1.3V; Number of Elements: 1; Power Dissipation: 360mW; Rise Time: 9ns; Turn-On Delay Time: 2.5ns; Input Capacitance: 27pF; On-State Resistance: 6R; Lead Free: Lead Free; Length: 2.92mm; Width: 1.3mm; Drain to Source Breakdown Voltage: 50V; Min Operating Temperature: -55°C; REACH SVHC: No SVHC; Packaging: Tape and Reel; Radiation Hardening: No; Height: 0.93mm; Drain to Source Voltage (Vdss): 50V; Current Rating: 220mA; Voltage Rating (DC): 50V; Weight: 0.03g; Continuous Drain Current (ID): 220mA; Number of Pins: 3; Nominal Vgs: 1.3V; Max Power Dissipation: 360mW; Fall Time: 9ns; Drain to Source Resistance: 3.5R; Contact Plating: Tin; Case/Package: SOT-23; Package Quantity: 1; Dual Supply Voltage: 50V; Mount: Surface Mount; Termination: SMD/SMT; Max Operating Temperature: 150°C
R3-R14 = CRG1206F4K7/10: Res Thick Film 1206 4.7K Ohm 1% 0.25W(1/4W) Â±100ppm/C Pad SMD T/R; Power_Rating: .25 W; MF: TE Connectivity; Voltage_Rating: 200 V; SnapEDA_Link: https://www.snapeda.com/parts/CRG1206F4K7/10/TE+Connectivity/view-part/?ref=snap; Package: 1206; Resistance: 4.7K; Value: *; MP: CRG1206F4K7/10; EU_RoHS_Compliance: Compliant with Exemptions; Tolerance: 1%; Check_prices: https://www.snapeda.com/parts/CRG1206F4K7/10/TE+Connectivity/view-part/?ref=eda

## Nets that join several sheets
+3.3: 07_ESP-12F_Circuit (7 pins), 06_Logic_Level_Shifters (12 pins)
+5: 01_Microcontroller_Circuit (11 pins), 04_Pin_Headers (D7.1 J4.02 J4.05 LS1.P), 03_Mini_USB_Circuit (D5.1 U4.4 U4.20), 02_5V_Regulator_Circuit (C5.1 TP6.1 U3.2 U3.4), 06_Logic_Level_Shifters (6 pins)
GND: 01_Microcontroller_Circuit (14 pins), 04_Pin_Headers (6 pins), 03_Mini_USB_Circuit (13 pins), 02_5V_Regulator_Circuit (C5.2 U3.1), 07_ESP-12F_Circuit (C14.2 C15.2 R19.1 U7.15)
3.3 MISO: 04_Pin_Headers (J7.05), 06_Logic_Level_Shifters (Q3.2 R9.1)
3.3 MOSI: 04_Pin_Headers (J7.04), 06_Logic_Level_Shifters (Q2.2 R6.1)
3.3 NSS: 04_Pin_Headers (J7.03), 06_Logic_Level_Shifters (Q1.2 R5.1)
3.3 RX: 07_ESP-12F_Circuit (U7.21), 06_Logic_Level_Shifters (Q6.2 R14.1)
3.3 SCK: 04_Pin_Headers (J8.01), 06_Logic_Level_Shifters (Q4.2 R10.1)
3.3 TX: 07_ESP-12F_Circuit (U7.22), 06_Logic_Level_Shifters (Q5.2 R13.1)
3V3OUT: 04_Pin_Headers (J8.02), 03_Mini_USB_Circuit (C7.1 U4.17)
A0: 01_Microcontroller_Circuit (U1.23), 04_Pin_Headers (J8.04)
A1: 01_Microcontroller_Circuit (U1.24), 04_Pin_Headers (J8.05)
A2: 01_Microcontroller_Circuit (U1.25), 04_Pin_Headers (J6.01)
A3: 01_Microcontroller_Circuit (U1.26), 04_Pin_Headers (J6.02)
A4: 01_Microcontroller_Circuit (U1.27), 04_Pin_Headers (J6.03)
A5: 01_Microcontroller_Circuit (U1.28), 04_Pin_Headers (J6.04)
A6: 01_Microcontroller_Circuit (U1.19), 04_Pin_Headers (J6.05)
A7: 01_Microcontroller_Circuit (U1.22), 04_Pin_Headers (J4.01)
AREF: 01_Microcontroller_Circuit (C4.1 U1.20), 04_Pin_Headers (J8.03)
CBUS0: 01_Microcontroller_Circuit (R2.2), 03_Mini_USB_Circuit (U4.23)
CBUS1: 01_Microcontroller_Circuit (R2.4), 03_Mini_USB_Circuit (U4.22)
D2: 01_Microcontroller_Circuit (U1.32), 04_Pin_Headers (J3.05)
D3: 01_Microcontroller_Circuit (U1.1), 04_Pin_Headers (J5.01)
D4: 01_Microcontroller_Circuit (U1.2), 04_Pin_Headers (J5.02)
D5: 01_Microcontroller_Circuit (U1.9), 04_Pin_Headers (J5.03)
D6: 01_Microcontroller_Circuit (U1.10), 04_Pin_Headers (J5.04)
D7/Buzzer: 01_Microcontroller_Circuit (U1.11), 04_Pin_Headers (R20.1)
D8: 01_Microcontroller_Circuit (U1.12), 04_Pin_Headers (J7.01)
D9: 01_Microcontroller_Circuit (U1.13), 04_Pin_Headers (J7.02)
D10/NSS: 01_Microcontroller_Circuit (U1.14), 06_Logic_Level_Shifters (Q1.3 R3.1)
D11/MOSI: 01_Microcontroller_Circuit (J1.B2 U1.15), 06_Logic_Level_Shifters (Q2.3 R4.1)
D12/MISO: 01_Microcontroller_Circuit (J1.A1 U1.16), 06_Logic_Level_Shifters (Q3.3 R7.1)
D13/SCK: 01_Microcontroller_Circuit (J1.A2 R2.1 U1.17), 06_Logic_Level_Shifters (Q4.3 R8.1)
RESET: 01_Microcontroller_Circuit (J1.A3 R1.4 S1.1 U1.29), 04_Pin_Headers (J3.03 J4.03), 03_Mini_USB_Circuit (C6.2)
RXD: 01_Microcontroller_Circuit (R1.7), 03_Mini_USB_Circuit (U4.5)
TXD: 01_Microcontroller_Circuit (R1.8), 03_Mini_USB_Circuit (U4.1)